# EAGLE design MySensors_AirQuality_Board_2017-11-14 (EAGLE 8.3.2)
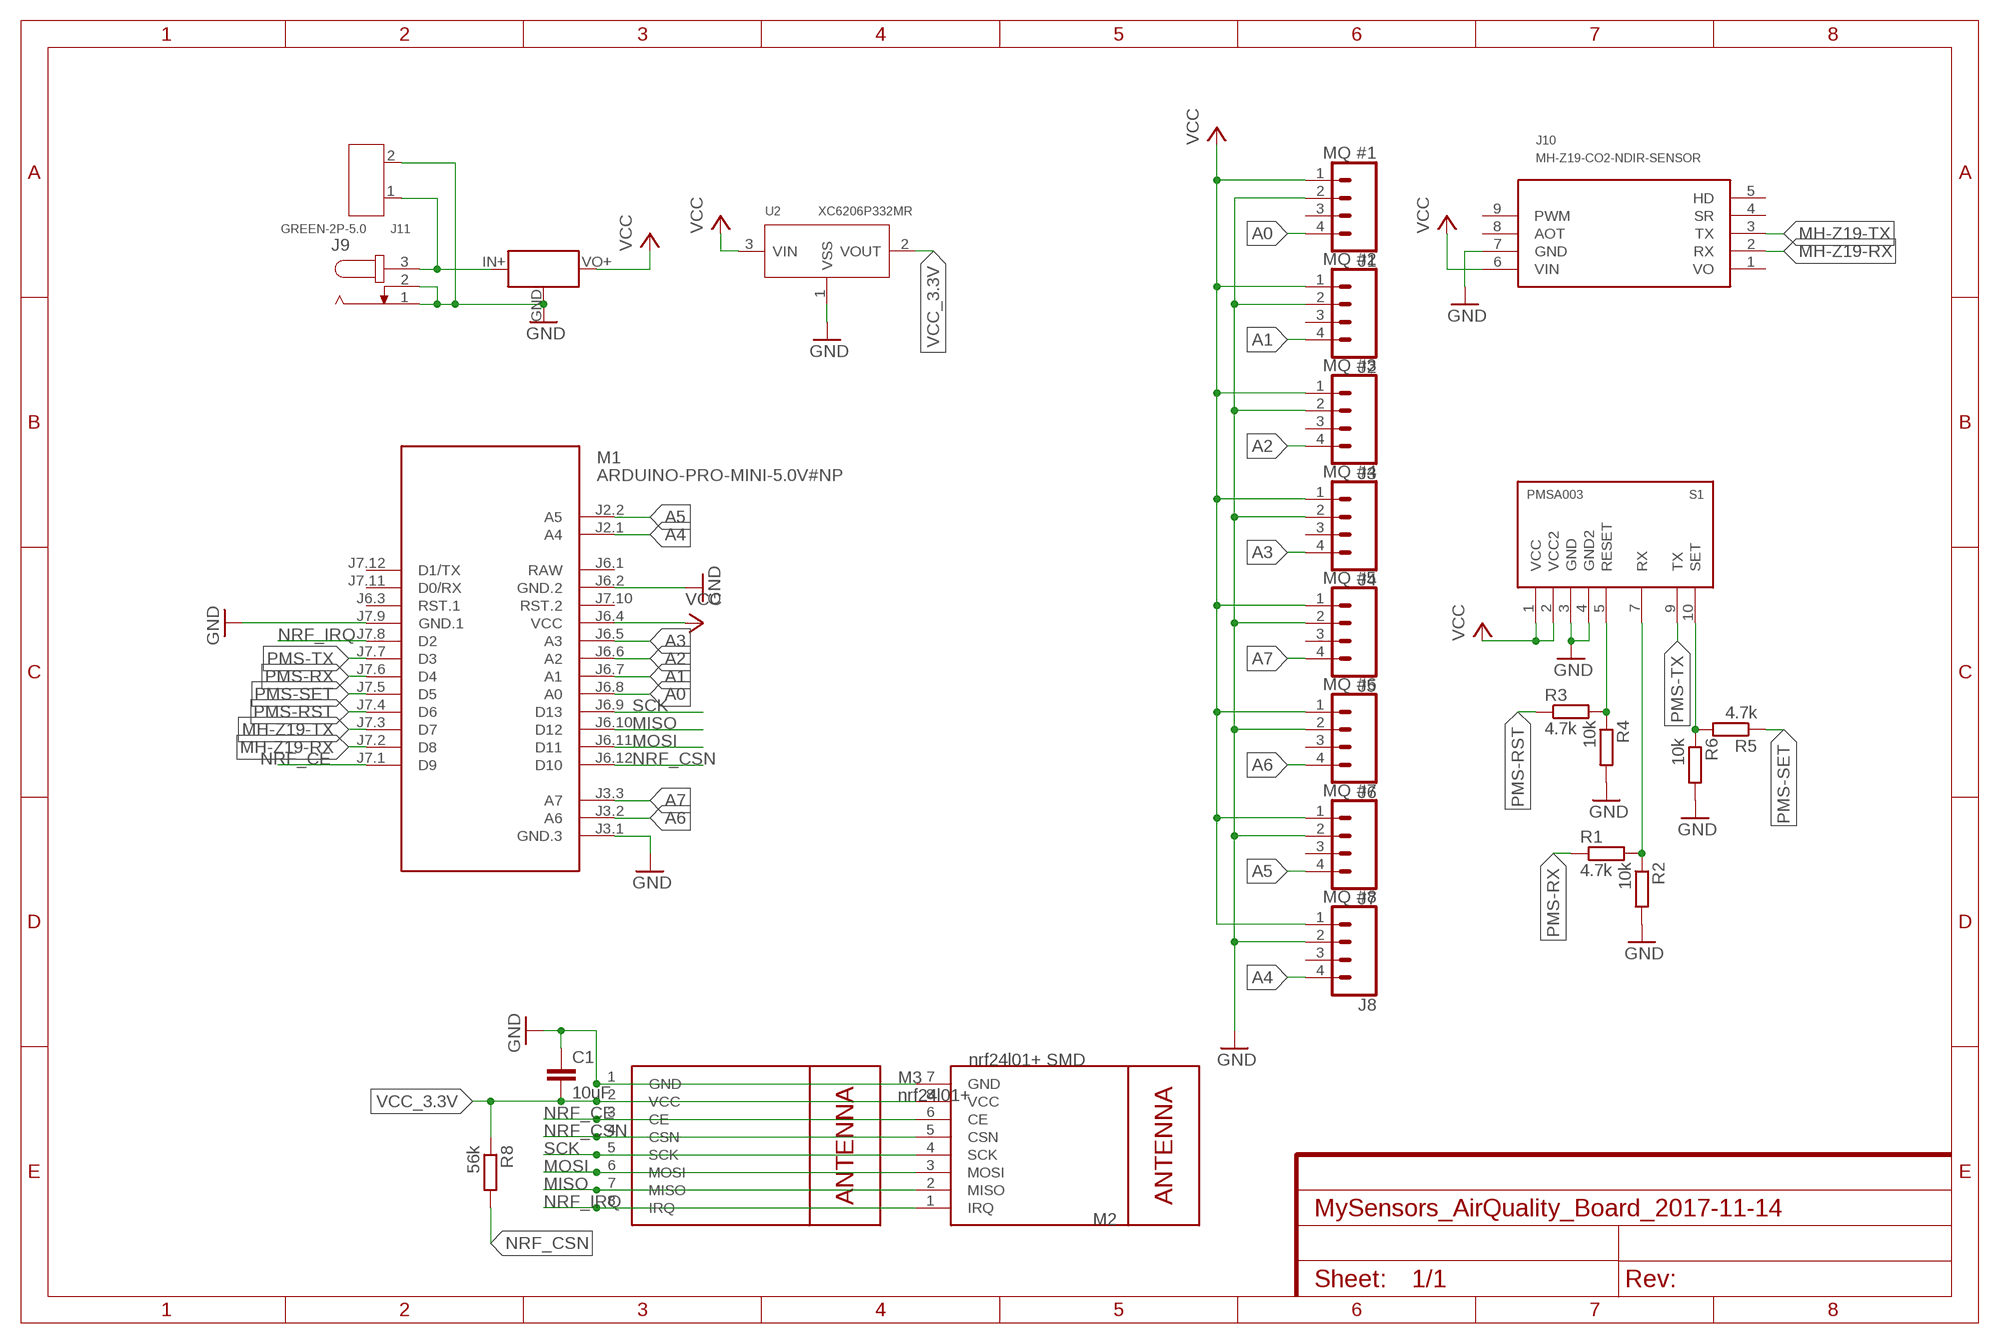
[diagram p0: schematic, sheet 1]
FRAME1 (FRAME-A4L): CNAME: MySensors AirQuality Board; CREVISION: 0.01; DESIGNER: R. Kainhofer, 2017-11-03

## Parts
C1  10uF  C-EUC0805  [C0805]
J1  MQ #1  CONN_04  [1X04]
J2  MQ #2  CONN_04  [1X04]
J3  MQ #3  CONN_04  [1X04]
J4  MQ #4  CONN_04  [1X04]
J5  MQ #5  CONN_04  [1X04]
J6  MQ #6  CONN_04  [1X04]
J7  MQ #7  CONN_04  [1X04]
J8  MQ #8  CONN_04  [1X04]
J9  JACK-PLUG1  [SPC4078]
J10  MH-Z19-CO2-NDIR-SENSOR  [MH-Z19]
J11  GREEN-2P-5.0  SCREW-TERMINAL-GREEN(2P-5.0)  [H2-5.0-10.5X8.0MM]
M1  ARDUINO-PRO-MINI-5.0V#NP  [ARDUINO-PRO-MINI#NP]
M2  nrf24l01+ SMD  WIRELESS-NRF24L01SMD  [WIRELESS-NRF24L01-SMD]
M3  nrf24l01+  WIRELESS-NRF24L01STANDARD  [WIRELESS-NRF24L01]
R1  4.7k  R-EU_R0805  [R0805]
R2  10k  R-EU_R0805  [R0805]
R3  4.7k  R-EU_R0805  [R0805]
R4  10k  R-EU_R0805  [R0805]
R5  4.7k  R-EU_R0805  [R0805]
R6  10k  R-EU_R0805  [R0805]
R8  56k  R-EU_R0805  [R0805]
S1  PMSA003  [PMSA003]
U2  XC6206P332MR  PMIC-LDO-XC6206P332MR-G(SOT23)  [SOT-23]
U$2  MINI_BUCK_CONVERTER  [MINI_BUCK_CONVERTER]

## Nets
A0: J1.4 M1.J6.8(A0)
A1: J2.4 M1.J6.7(A1)
A2: J3.4 M1.J6.6(A2)
A3: J4.4 M1.J6.5(A3)
A4: J8.4 M1.J2.1(A4)
A5: J7.4 M1.J2.2(A5)
A6: J6.4 M1.J3.2(A6)
A7: J5.4 M1.J3.3(A7)
GND: C1.1 J1.2 J2.2 J3.2 J4.2 J5.2 J6.2 J7.2 J8.2 J9.1 J9.2 J10.7(GND) J11.2 M1.J3.1(GND.3) M1.J6.2(GND.2) M1.J7.9(GND.1) M2.7(GND) M3.1(GND) R2.2 R4.2 R6.2 S1.3(GND) S1.4(GND2) U2.1(VSS) U$2.GND
MH-Z19-RX: J10.2(RX) M1.J7.2(D8)
MH-Z19-TX: J10.3(TX) M1.J7.3(D7)
MISO: M1.J6.10(D12) M2.2(MISO) M3.7(MISO)
MOSI: M1.J6.11(D11) M2.3(MOSI) M3.6(MOSI)
N$2: J9.3 J11.1 U$2.IN+(VIN)
NRF_CE: M1.J7.1(D9) M2.6(CE) M3.3(CE)
NRF_CSN: M1.J6.12(D10) M2.5(CSN) M3.4(CSN) R8.2
NRF_IRQ: M1.J7.8(D2) M2.1(IRQ) M3.8(IRQ)
PMS-RESET-3.3V: R3.2 R4.1 S1.5(RESET)
PMS-RST: M1.J7.4(D6) R3.1
PMS-RX: M1.J7.6(D4) R1.1
PMS-RX-3.3V: R1.2 R2.1 S1.7(RX)
PMS-SET: M1.J7.5(D5) R5.1
PMS-SET_3.3V: R5.2 R6.1 S1.10(SET)
PMS-TX: M1.J7.7(D3) S1.9(TX)
SCK: M1.J6.9(D13) M2.4(SCK) M3.5(SCK)
VCC: J1.1 J2.1 J3.1 J4.1 J5.1 J6.1 J7.1 J8.1 J10.6(VIN) M1.J6.4(VCC) S1.1(VCC) S1.2(VCC2) U2.3(VIN) U$2.VO+(VOUT)
VCC_3.3V: C1.2 M2.8(VCC) M3.2(VCC) R8.1 U2.2(VOUT)
Unconnected: J1.3 J2.3 J3.3 J4.3 J5.3 J6.3 J7.3 J8.3 J10.4(SR) J10.5(HD) J10.8(AOT) J10.9(PWM) M1.J6.3(RST.1) M1.J7.10(RST.2) M1.J7.11(D0/RX) M1.J7.12(D1/TX)

## Power pins joined to a net without a drawn wire
RAW: M1.J6.1(RAW)
VO: J10.1(VO)

## Library data of the parts
C1 = rcl:C-EU: CAPACITOR, European symbol
J1-J8 = SparkFun-Connectors:CONN_04: Multi connection point. Often used as Generic Header-pin footprint for 0.1 inch spaced/style header connections On any of the 0.1 inch spaced packages, you can populate with these: Break Away Headers - Straight <https://www.sparkfun.com/products/116> (PRT-00116) Break Away Male Headers - Right Angle <https://www.sparkfun.com/products/553> (PRT-00553) Female Headers <https://www.sparkfun.com/products/115> (PRT-00115) Break Away Headers - Machine Pin <https://www.sparkfun.com/products/117> (PRT-00117) Break Away Female Headers - Swiss Machine Pin <https://www.sparkfun.com/products/743> (PRT-00743) For SCREWTERMINALS and SPRING TERMINALS visit here: Screw Terimnals on SparkFun.com <https://www.sparkfun.com/search/results?term=Screw+Terminals> (5mm/3.5mm/2.54mm spacing) This device is also useful as a general connection point to wire up your design to another part of your project. Our various solder wires solder well into these plated through hole pads. Hook-Up Wire - Assortment (Stranded, 22 AWG) <https://www.sparkfun.com/products/11375> (PRT-11375) Hook-Up Wire - Assortment (Solid Core, 22 AWG) <https://www.sparkfun.com/products/11367> (PRT-11367) View the entire wire category on our website here <https://www.sparkfun.com/categories/141> Special notes: Molex polarized connector foot print use with SKU : PRT-08231 with associated crimp pins and housings. 1MM SMD Version SKU: PRT-10208; PROD_ID: CONN-09696
J9 = con-jack:JACK-PLUG: DC POWER JACK Power Jack, DC, Right Angle, Through Hole, Rated 5A at 16VDC, PC Terminals Distributor: Farnell (www.Farnell.de) Drawing: 84N1161.pdf / 84N1162.pdf Manufacturer: SPC Technology (www.spctechnology.com) Type: SPC4077 / SPC 4078; OC_FARNELL: unknown; OC_NEWARK: unknown
J10 = mh-z19:MH-Z19: MH-Z19 - CO2 NDIR SENSOR
J11 = Seeed-Connector:SCREW-TERMINAL-GREEN(2P-5.0): 320110031
M1 = diy-modules:ARDUINO-PRO-MINI-*#NP: Arduino Pro Mini (and compatible devices) without programming pads More details available here: https://www.arduino.cc/en/Main/ArduinoBoardProMini Click here to find device on ebay.com <http://www.ebay.com/sch/arduino+pro+mini>
M2 M3 = nrf24l01plus:WIRELESS-NRF24L01: 2.4 GHz Wireless Module based on NRF24L01 chip
R1-R6 = resistor:R-EU_: RESISTOR, European symbol
R8 = rcl:R-EU_: RESISTOR, European symbol
S1 = opentools-sensors:PMS: PLANTOWER PMSx003 Laser PM2.5 Dust Sensor
U2 = Seeed-IC:PMIC-LDO-XC6206P332MR-G(SOT23): 310030099; MPN: XC6206P332MR-G; VALUE: XC6206P332MR-G-SOT23
U$2 = opentools-sensors:MINI_BUCK_CONVERTER: 4.5-40V Step Down Buck Converter

## Net classes
0 default: width 0.305 mm, clearance 0.203 mm

## Board
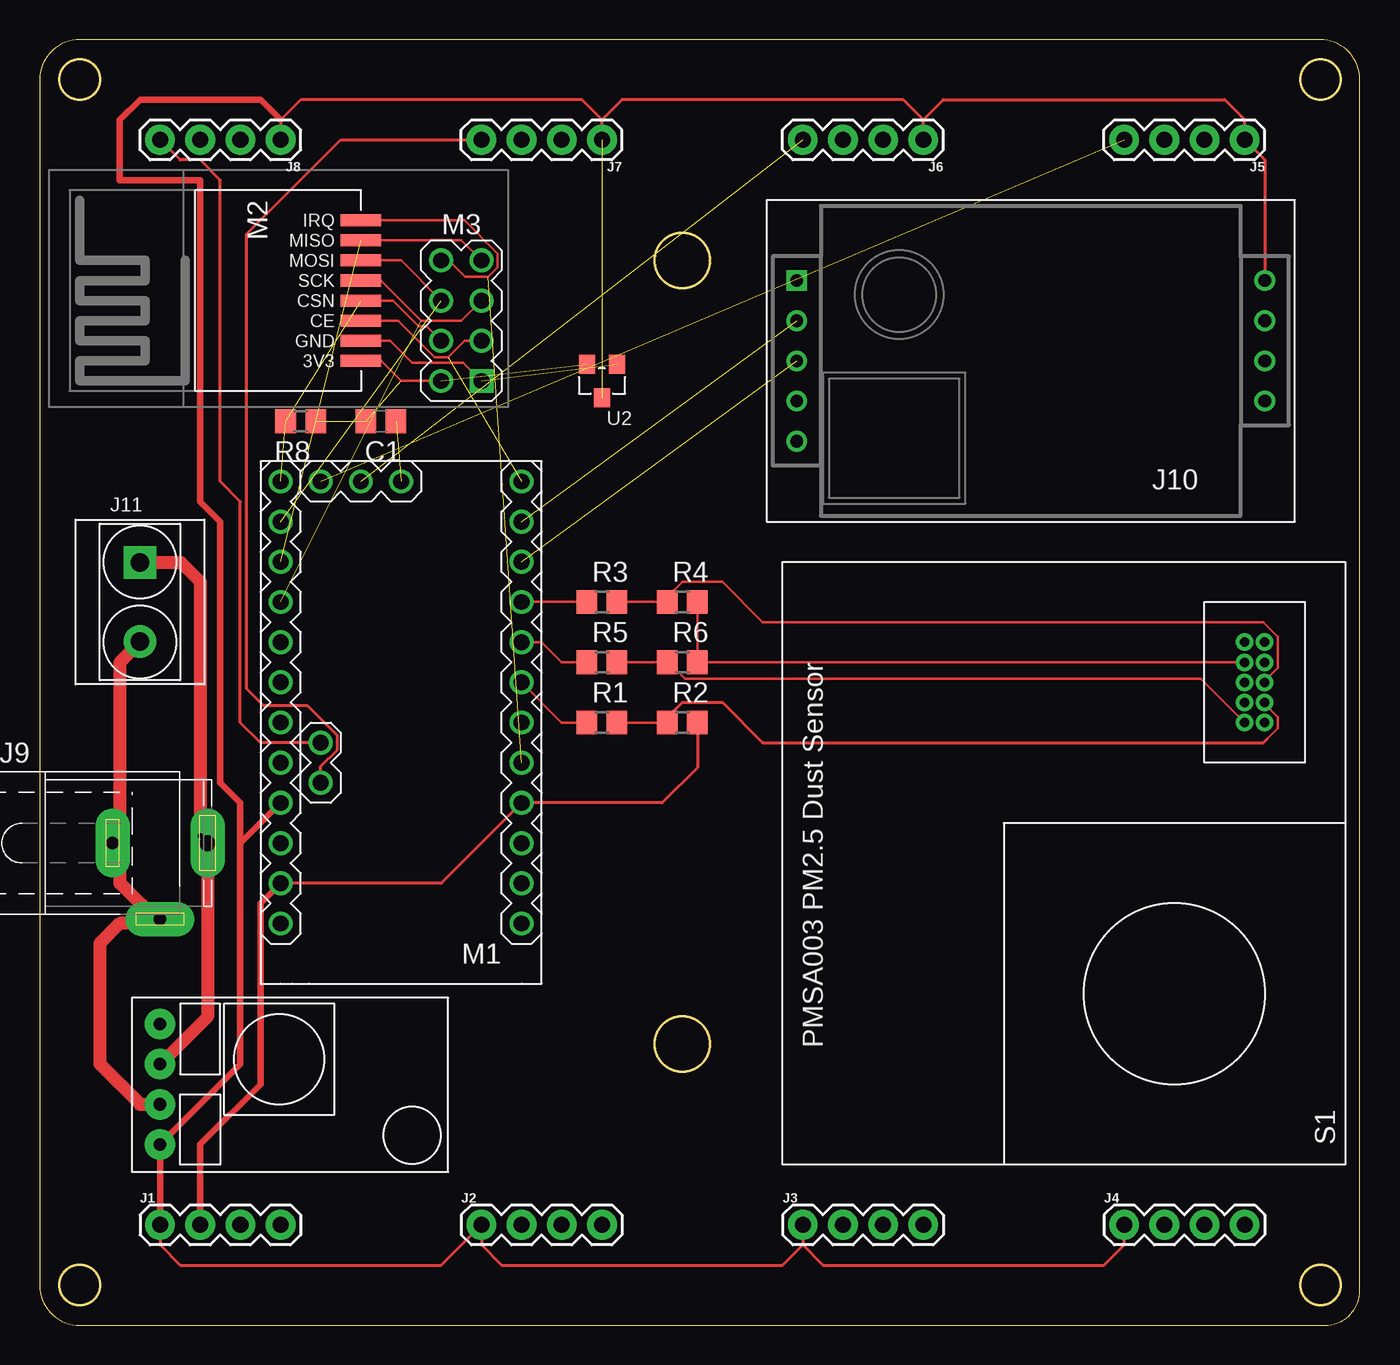
[diagram p1: board, top side]
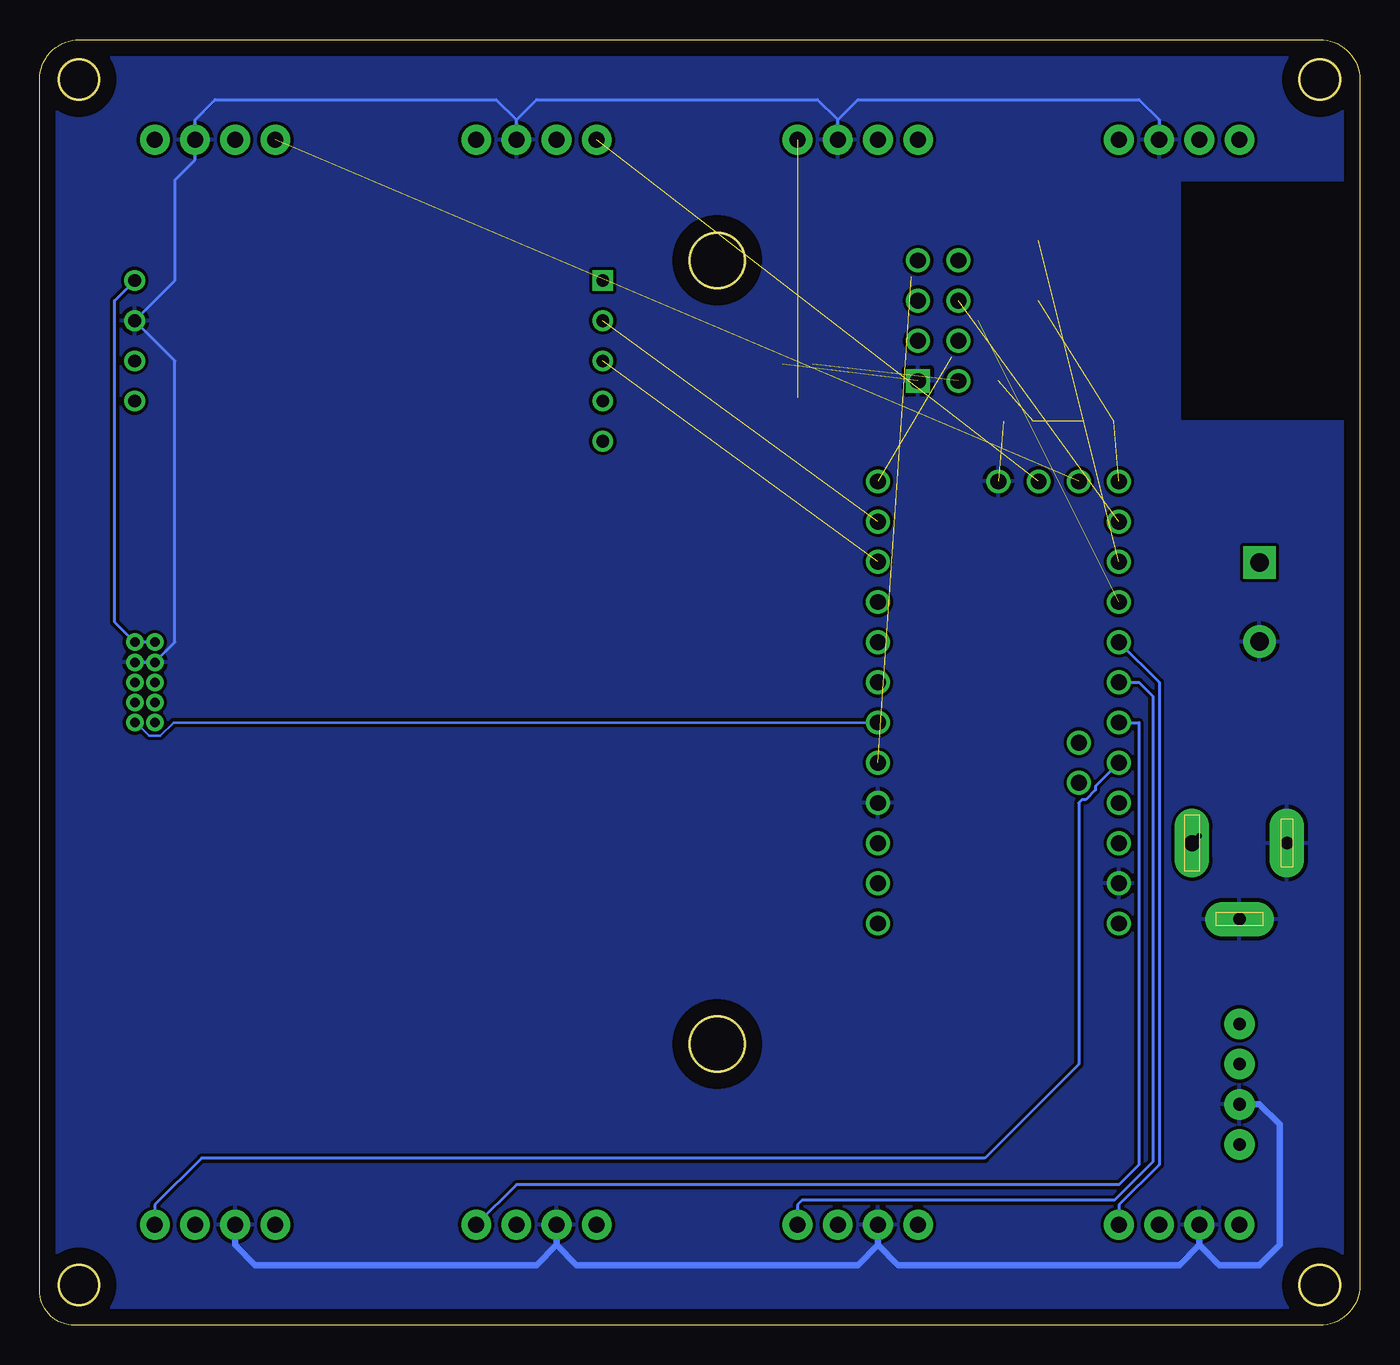
[diagram p2: board, bottom side, seen from below]

Size 83.49 x 81.27 mm. Coordinates in mm from the lower left corner, seen from the top.
Outline: 0,78.73 0,2.54 arc90 2.54,0 81.28,0 arc90 83.49,2.21 83.49,78.74 arc90 80.96,81.27 2.54,81.27 arc90 0,78.73
Outline: circle at 2.54,78.74 radius 1.27
Outline: circle at 2.54,2.54 radius 1.27
Outline: circle at 81,2.54 radius 1.27
Outline: circle at 81,78.74 radius 1.27
Outline: circle at 40.64,67.31 radius 1.75
Outline: circle at 40.64,17.78 radius 1.75
Copper layers (1*16): Top 0.035mm / dielectric 1.5mm / Bottom 0.035mm
Design rules "default": minimum track width 6mil, minimum drill 0.35mm, track to track 6mil, track to pad 6mil, pad to pad 6mil, via to via 6mil, smd to smd 6mil, copper to edge 40mil, drill to drill 6mil, minimum pad ring 10mil, minimum via ring 8mil, stop-mask expansion 4mil, vias tented up to drill 0mil, thermal gap 10mil

### Footprints (pad centres in the part's own frame; a part is rotated, then mirrored left to right if it is on the bottom)
C0805 = smd 1.3 x 1.5: 1 -0.95,0; 2 0.95,0
1X04 = drill 1.016 pad 1.88: 1 0,0; 2 2.54,0; 3 5.08,0; 4 7.62,0
SPC4078 = drill 0.8 pad 2.184 long: 1 -3,0; 2 0,-4.8 | drill 1 pad 2.184 long: 3 3,0
MH-Z19 = drill 0.8 square: 1 29.591,0 | drill 0.8: 2 29.591,2.54; 3 29.591,5.08; 4 29.591,7.62; 5 29.591,10.16; 6 0,0; 7 0,2.54; 8 0,5.08; 9 0,7.62
H2-5.0-10.5X8.0MM = drill 1.168 pad 2.032 square: 1 0,2.5 | drill 1.168 pad 2.032: 2 0,-2.5
ARDUINO-PRO-MINI#NP = drill 1: J2.1 -1.27,5.08; J2.2 -3.81,5.08; J3.1 15.24,0; J3.2 15.24,2.54; J3.3 15.24,5.08; J6.1 -12.7,7.62; J6.2 -10.16,7.62; J6.3 -7.62,7.62; J6.4 -5.08,7.62; J6.5 -2.54,7.62; J6.6 0,7.62; J6.7 2.54,7.62; J6.8 5.08,7.62; J6.9 7.62,7.62; J6.10 10.16,7.62; J6.11 12.7,7.62; J6.12 15.24,7.62; J7.1 15.24,-7.62; J7.2 12.7,-7.62; J7.3 10.16,-7.62; J7.4 7.62,-7.62; J7.5 5.08,-7.62; J7.6 2.54,-7.62; J7.7 0,-7.62; J7.8 -2.54,-7.62; J7.9 -5.08,-7.62; J7.10 -7.62,-7.62; J7.11 -10.16,-7.62; J7.12 -12.7,-7.62
WIRELESS-NRF24L01-SMD = smd 2.54 x 0.762: 1 1.27,0; 2 1.27,1.27; 3 1.27,2.54; 4 1.27,3.81; 5 1.27,5.08; 6 1.27,6.35; 7 1.27,7.62; 8 1.27,8.89
WIRELESS-NRF24L01 = drill 1 square: 1 -12.7,6.35 | drill 1: 2 -10.16,6.35; 3 -12.7,3.81; 4 -10.16,3.81; 5 -12.7,1.27; 6 -10.16,1.27; 7 -12.7,-1.27; 8 -10.16,-1.27
R0805 = smd 1.3 x 1.5: 1 -0.95,0; 2 0.95,0
PMSA003 = drill 0.6: 1 5.08,-5.08; 2 5.08,-6.35; 3 6.35,-5.08; 4 6.35,-6.35; 5 7.62,-5.08; 6 7.62,-6.35; 7 8.89,-5.08; 8 8.89,-6.35; 9 10.16,-5.08; 10 10.16,-6.35
SOT-23 = smd 1.016 x 1.2: 1 -0.95,-1.06; 2 0.95,-1.06; 3 0,1.06
MINI_BUCK_CONVERTER = drill 0.8 pad 1.93: EN 1.27,1.27; GND 6.35,1.27; IN+ 3.81,1.27; VO+ 8.89,1.27

### Placement (x,y rotation side)
C1  21.59,57.15 180 top
J1  7.62,6.35 0 top
J2  27.94,6.35 0 top
J3  48.26,6.35 0 top
J4  68.58,6.35 0 top
J5  76.2,74.93 180 top
J6  55.88,74.93 180 top
J7  35.56,74.93 180 top
J8  15.24,74.93 180 top
J9  7.62,30.48 0 top
J10  77.47,66.04 180 top
J11  6.35,45.72 0 top
M1  22.86,38.1 90 top
M2  21.59,69.85 180 top
M3  15.24,66.04 180 top
R1  35.56,38.1 0 top
R2  40.64,38.1 0 top
R3  35.56,45.72 0 top
R4  40.64,45.72 0 top
R5  35.56,41.91 0 top
R6  40.64,41.91 0 top
R8  16.51,57.15 180 top
S1  82.55,48.26 270 top
U2  35.56,59.69 180 top
U$2  6.35,20.32 270 top

### Tracks (layer width: path | path; a pad name or v marks a point on that pad's centre or on a via)
A0
  Bottom 0.203: M1.J6.8 12.7,40.64 12.7,10.16 15.24,7.62 J1.4
A1
  Bottom 0.203: M1.J6.7 13.97,40.64 13.11,39.78 13.11,10.33 15.53,7.91 35.27,7.91 35.56,7.62 J2.4
A2
  Bottom 0.203: M1.J6.6 13.97,38.1 13.97,10.16 15.24,8.89 53.34,8.89 J3.4
A3
  Bottom 0.203: M1.J6.5 16.72,34.08 16.72,33.85 17.34,33.23 17.57,33.23 17.78,33.02 17.78,16.51 23.72,10.57 73.25,10.57 76.2,7.62 J4.4
A4
  Top 0.203: M1.J2.1 13.97,36.83 12.7,38.1 12.7,52.07 11.43,53.34 11.43,72.39 10.16,73.66 8.89,73.66 J8.4
A5
  Top 0.203: M1.J2.2 17.78,35.33 18.84,36.39 18.84,37.27 16.95,39.16 14.18,39.16 13.11,40.23 13.11,68.99 19.05,74.93 J7.4
A6  (1 unrouted)
A7  (1 unrouted)
GND  (via drill 0.35)  (2 unrouted)
  Top 0.152: M2.7 22.17,62.23 23.55,60.84 26.79,60.84 M3.1 | R4.2 R6.2 S1.4
  Top 0.203: R2.2 41.59,35.24 39.37,33.02 M1.J7.9 25.4,27.94 M1.J6.2
  Top 0.406: M1.J6.2 13.97,26.67 13.97,15.24 10.16,11.43 J1.2
  Top 0.813: v6.35,43.18 5.08,41.91 5.08,27.94 7.62,25.4 5.08,25.4 3.81,24.13 3.81,16.51 6.35,13.97 U$2.GND
  Bottom 0.203: S1.3 S1.4 74.93,43.18 74.93,60.96 J10.7 74.93,66.04 74.93,72.39 73.66,73.66 J5.2 73.66,76.2 72.39,77.47 54.61,77.47 53.34,76.2 | J6.2 53.34,76.2 | 53.34,76.2 52.07,77.47 34.29,77.47 33.02,76.2 | J7.2 33.02,76.2 | 33.02,76.2 31.75,77.47 13.97,77.47 12.7,76.2 J8.2
  Bottom 0.406: 7.9,25.4 J9.2 | J1.2 10.16,5.08 | 10.16,5.08 11.43,3.81 29.21,3.81 30.48,5.08 | J2.2 30.48,5.08 | 30.48,5.08 31.75,3.81 49.53,3.81 50.8,5.08 | J3.2 50.8,5.08 | 50.8,5.08 52.07,3.81 69.85,3.81 71.12,5.08 J4.2 | U$2.GND 6.35,13.97 5.08,12.7 5.08,5.08 6.35,3.81 8.89,3.81 10.16,5.08
  Bottom 0.813: J11.2 v6.35,43.18
  pour Bottom: 0,0 83.82,0 83.82,81.28 0,81.28 0,73.66 0,72.39 11.43,72.39 11.43,57.15 0,57.15
MH-Z19-RX  (1 unrouted)
MH-Z19-TX  (1 unrouted)
MISO  (1 unrouted)
  Top 0.152: M2.2 26.67,68.58 M3.7
MOSI  (1 unrouted)
  Top 0.152: M2.3 22.86,67.31 M3.6
N$2  (via drill 0.35)
  Top 0.813: J11.1 8.93,48.22 10.16,46.99 v10.16,30.94 | J9.3 10.62,19.51 U$2.IN+
  Bottom 0.813: v10.16,30.94 J9.3
NRF_CE  (1 unrouted)
  Top 0.152: M2.6 22.67,63.5 24.97,61.2 25.83,61.2 26.86,62.23 M3.3
NRF_CSN  (2 unrouted)
  Top 0.152: M2.5 22.36,64.77 23.98,63.14 24.49,63.14 M3.4
NRF_IRQ  (1 unrouted)
  Top 0.152: M2.1 26.86,69.85 28.97,67.74 28.97,66.88 28.37,66.28 26.91,66.28 25.87,67.31 M3.8
PMS-RESET-3.3V
  Top 0.152: R3.2 R4.1 39.69,46.04 40.64,46.99 43.18,46.99 45.72,44.45 77.38,44.45 78.3,43.53 78.3,41.57 77.47,40.73 S1.5
PMS-RST
  Top 0.152: M1.J7.4 R3.1
PMS-RX
  Top 0.152: M1.J7.6 33.02,38.1 R1.1
PMS-RX-3.3V
  Top 0.152: R1.2 R2.1 39.8,38.1 | 77.62,37.07 78.3,37.76 78.3,38.45 77.47,39.28 S1.7
  Top 0.203: R2.1 39.69,38.42 40.64,39.37 43.18,39.37 45.72,36.83 77.38,36.83 77.62,37.07
PMS-SET
  Top 0.152: M1.J7.5 31.75,43.18 33.02,41.91 R5.1
PMS-SET_3.3V
  Top 0.152: R5.2 R6.1 39.8,41.91 40.82,40.88 73.42,40.88 S1.10
PMS-TX
  Bottom 0.152: M1.J7.7 75.02,38.1 75.86,37.27 76.55,37.27 77.38,38.1 S1.9
SCK  (1 unrouted)
  Top 0.152: M2.4 21.59,66.04 24.13,63.5 26.67,63.5 M3.5
VCC  (1 unrouted)
  Top 0.203: J10.6 77.47,73.66 J5.1 76.2,76.2 74.93,77.47 57.15,77.47 55.88,76.2 | J1.1 7.62,5.08 8.89,3.81 25.4,3.81 J2.1 27.94,5.08 29.21,3.81 46.99,3.81 48.26,5.08 | J3.1 48.26,5.08 | 48.26,5.08 49.53,3.81 67.31,3.81 68.58,5.08 J4.1 | J6.1 55.88,76.2 | 55.88,76.2 54.61,77.47 36.83,77.47 35.56,76.2 | J7.1 35.56,76.2 | 35.56,76.2 34.29,77.47 16.51,77.47 15.24,76.2 J8.1
  Top 0.406: J1.1 U$2.VO+ 12.7,16.51 12.7,30.48 | M1.J6.4 12.7,30.48 | 12.7,30.48 12.7,33.02 11.43,34.29 11.43,50.8 10.16,52.07 10.16,72.39 5.08,72.39 5.08,76.2 6.35,77.47 13.97,77.47 15.24,76.2
  Bottom 0.203: S1.2 S1.1 78.74,44.45 78.74,64.77 J10.6
VCC_3.3V  (3 unrouted)
  Top 0.152: M2.8 21.59,60.96 22.86,59.69 M3.2